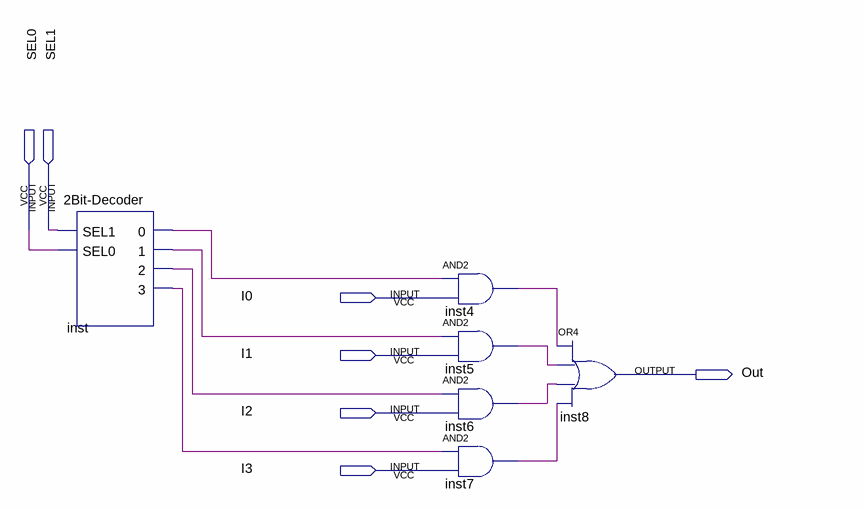
[diagram p0: schematic sheet]
// Quartus schematic 4to1-MUX.bdf as structural Verilog: 6 symbols, 7 pins
module \4to1-MUX  (
  input  SEL0,
  input  SEL1,
  input  I0,
  input  I1,
  input  I2,
  input  I3,
  output Out
);

  wire inst4_out, inst5_out, inst6_out, inst7_out, inst_0, inst_1, inst_2, inst_3;

  \2Bit-Decoder  inst (.SEL1(SEL1), .SEL0(SEL0), .\0 (inst_0), .\1 (inst_1), .\2 (inst_2), .\3 (inst_3));
  and inst4 (inst4_out, inst_0, I0);
  and inst5 (inst5_out, inst_1, I1);
  and inst6 (inst6_out, inst_2, I2);
  and inst7 (inst7_out, inst_3, I3);
  or inst8 (Out, inst4_out, inst5_out, inst6_out, inst7_out);
endmodule
